# Altium schematic sheet mcu_shield.SchDoc
size A4
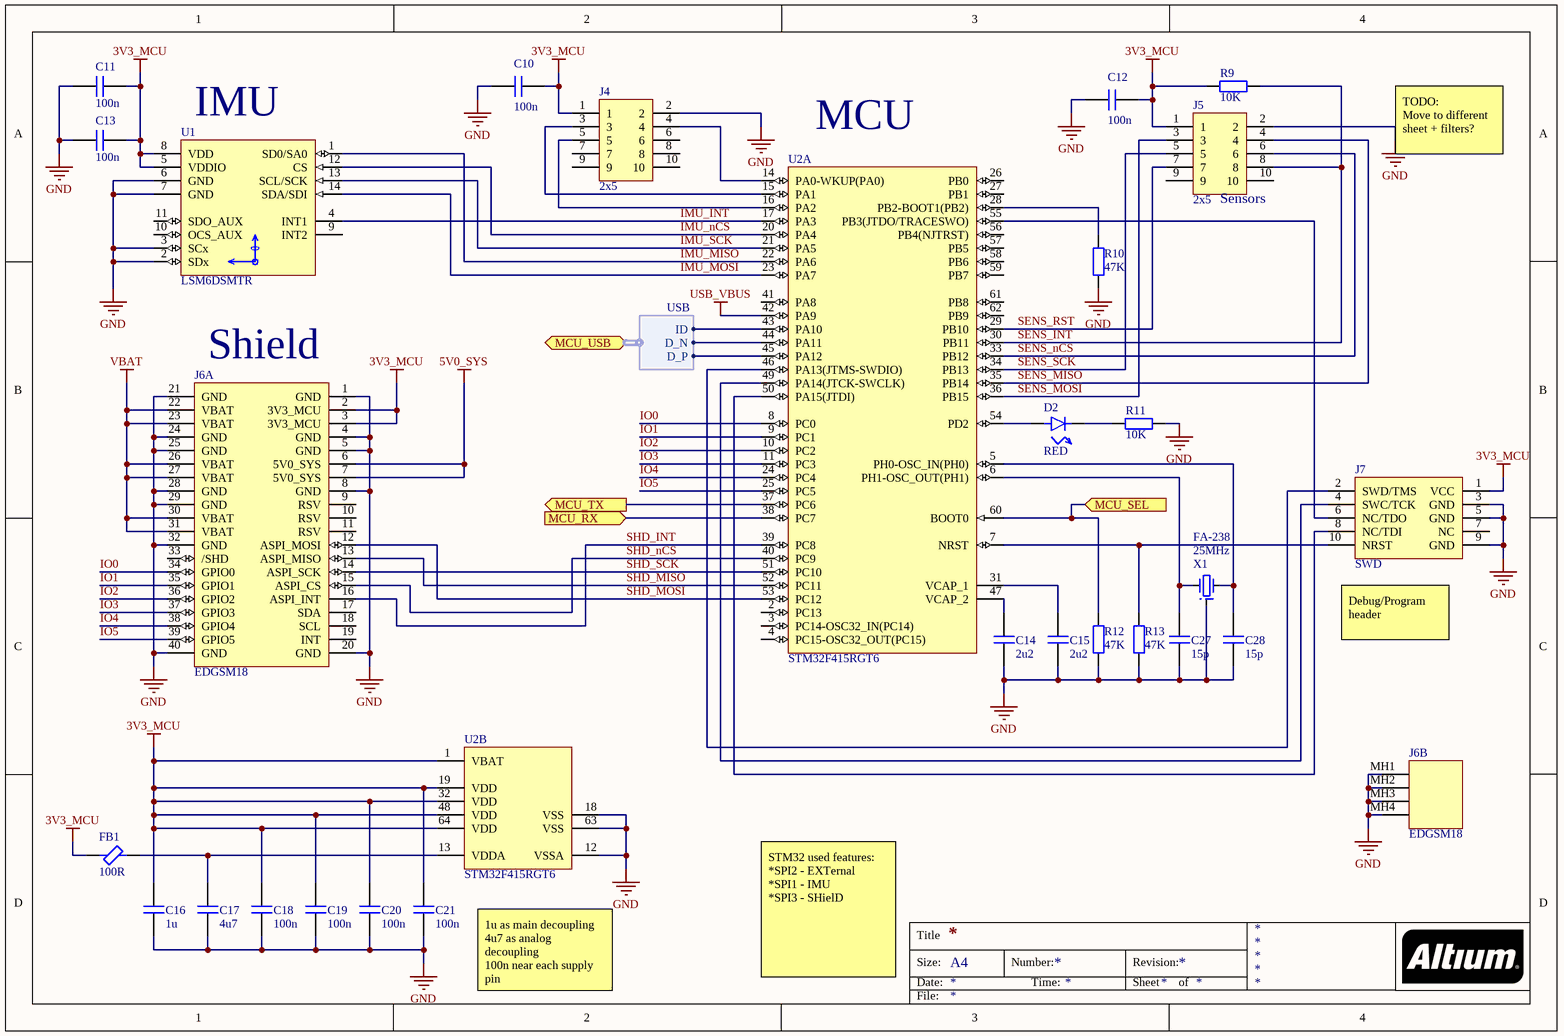
[diagram p0: mcu_shield.SchDoc]

## Parts
C10  value 100n  [CAPC1005X06N]  (hidden comment: cap)
C11  value 100n  [CAPC1005X06N]  (hidden comment: cap)
C12  value 100n  [CAPC1005X06N]  (hidden comment: cap)
C13  value 100n  [CAPC1005X06N]  (hidden comment: cap)
C14  value 2u2  [CAPC1608X08N]  (hidden comment: cap)
C15  value 2u2  [CAPC1608X08N]  (hidden comment: cap)
C16  value 1u  [CAPC1608X08N]  (hidden comment: cap)
C17  value 4u7  [CAPC1608X08N]  (hidden comment: cap)
C18  value 100n  [CAPC1005X06N]  (hidden comment: cap)
C19  value 100n  [CAPC1005X06N]  (hidden comment: cap)
C20  value 100n  [CAPC1005X06N]  (hidden comment: cap)
C21  value 100n  [CAPC1005X06N]  (hidden comment: cap)
C27  value 15p  [CAPC1005X06N]  (hidden comment: cap)
C28  value 15p  [CAPC1005X06N]  (hidden comment: cap)
D2  value RED  [CAPCP1005X06N]  (hidden comment: diode)
FB1  value 100R  [INDC1608X08N]  (hidden comment: ferrite)
J4  2x5  [hdr_2x5_50mil]
J5  2x5  [hdr_2x5_50mil]
J6  EDGSM18  [edgsm_shield]  (parts A,B of 2)
J7  SWD  [hdr_2x5_50mil]
R9  value 10K  [RESC1005X04N]  (hidden comment: res)
R10  value 47K  [RESC1005X04N]  (hidden comment: res)
R11  value 10K  [RESC1005X04N]  (hidden comment: res)
R12  value 47K  [RESC1005X04N]  (hidden comment: res)
R13  value 47K  [RESC1005X04N]  (hidden comment: res)
U1  LSM6DSMTR  [QFN50P300X250X86-14N]
U2  STM32F415RGT6  [STM-LQFP64_N]  (parts A,B of 2)
X1  FA-238  freq: 25MHz  [DFN220P320X70-4N]

## Ports
MCU_RX (in), MCU_SEL (in), MCU_TX (out), MCU_USB (harness USB)

## Harnesses
USB: D_N, D_P, ID

## Nets
3V3_MCU: C10.2 C11.1 C12.2 C13.1 C16.2 C18.2 C19.2 C20.2 C21.2 FB1.1 J4.1 J5.1 J6.2(3V3_MCU) J6.3(3V3_MCU) J7.1(VCC) R9.2 U1.5(VDDIO) U1.8(VDD) U2.1(VBAT) U2.19(VDD) U2.32(VDD) U2.48(VDD) U2.64(VDD)
5V0_SYS: J6.6(5V0_SYS) J6.7(5V0_SYS)
GND: C10.1 C11.2 C12.1 C13.2 C14.1 C15.1 C16.1 C17.1 C18.1 C19.1 C20.1 C21.1 C27.1 C28.1 J4.2 J5.2 J6.1(GND) J6.4(GND) J6.5(GND) J6.8(GND) J6.20(GND) J6.21(GND) J6.24(GND) J6.25(GND) J6.28(GND) J6.29(GND) J6.32(GND) J6.40(GND) J6.MH1 J6.MH2 J6.MH3 J6.MH4 J7.3(GND) J7.5(GND) J7.9(GND) R10.1 R11.2 R12.1 R13.1 U1.2(SDx) U1.3(SCx) U1.6(GND) U1.7(GND) U2.12(VSSA) U2.18(VSS) U2.63(VSS) X1.SHIELD
USB_VBUS: U2.42(PA9)
VBAT: J6.22(VBAT) J6.23(VBAT) J6.26(VBAT) J6.27(VBAT) J6.30(VBAT) J6.31(VBAT)
IMU_INT: U1.4(INT1) U2.17(PA3)
IMU_MISO: U1.1(SD0/SA0) U2.22(PA6)
IMU_MOSI: U1.14(SDA/SDI) U2.23(PA7)
IMU_nCS: U1.12(CS) U2.20(PA4)
IMU_SCK: U1.13(SCL/SCK) U2.21(PA5)
IO0: J6.34(GPIO0) U2.8(PC0)
IO1: J6.35(GPIO1) U2.9(PC1)
IO2: J6.36(GPIO2) U2.10(PC2)
IO3: J6.37(GPIO3) U2.11(PC3)
IO4: J6.38(GPIO4) U2.24(PC4)
IO5: J6.39(GPIO5) U2.25(PC5)
MCU_RX: U2.38(PC7) ; port MCU_RX
MCU_SEL: R12.2 U2.60(BOOT0) ; port MCU_SEL
MCU_TX: U2.37(PC6) ; port MCU_TX
SENS_INT: J5.8 R9.1 U2.30(PB11)
SENS_MISO: J5.4 U2.35(PB14)
SENS_MOSI: J5.3 U2.36(PB15)
SENS_nCS: J5.6 U2.33(PB12)
SENS_RST: J5.7 U2.29(PB10)
SENS_SCK: J5.5 U2.34(PB13)
SHD_INT: J6.16(ASPI_INT) U2.39(PC8)
SHD_MISO: J6.13(ASPI_MISO) U2.52(PC11)
SHD_MOSI: J6.12(ASPI_MOSI) U2.53(PC12)
SHD_nCS: J6.15(ASPI_CS) U2.40(PC9)
SHD_SCK: J6.14(ASPI_SCK) U2.51(PC10)
NetC14_2: C14.2 U2.47(VCAP_2)
NetC15_2: C15.2 U2.31(VCAP_1)
NetC17_2: C17.2 FB1.2 U2.13(VDDA)
NetC27_2: C27.2 U2.6(PH1-OSC_OUT(PH1)) X1.1
NetC28_2: C28.2 U2.5(PH0-OSC_IN(PH0)) X1.2
NetD2_A: D2.A U2.54(PD2)
NetD2_C: D2.C R11.1
NetJ4_3: J4.3 U2.15(PA1)
NetJ4_4: J4.4 U2.14(PA0-WKUP(PA0))
NetJ4_5: J4.5 U2.16(PA2)
NetJ7_2: J7.2(SWD/TMS) U2.46(PA13(JTMS-SWDIO))
NetJ7_4: J7.4(SWC/TCK) U2.49(PA14(JTCK-SWCLK))
NetJ7_6: J7.6(NC/TDO) U2.55(PB3(JTDO/TRACESWO))
NetJ7_8: J7.8(NC/TDI) U2.50(PA15(JTDI))
NetJ7_10: J7.10(NRST) R13.2 U2.7(NRST)
NetR10_2: R10.2 U2.28(PB2-BOOT1(PB2))
NetU2_43: U2.43(PA10) ; port MCU_USB.ID
NetU2_44: U2.44(PA11) ; port MCU_USB.D_N
NetU2_45: U2.45(PA12) ; port MCU_USB.D_P

Not connected (* = marked no-connect by the designer): J4 6 7 8 9 10; J5 9 10; J6 9(RSV) 10(RSV) 11(RSV) 17(SDA) 18(SCL) 19(INT) 33(/SHD); J7 7(NC); U1 9(INT2) 10(OCS_AUX) 11(SDO_AUX); U2 2(PC13) 3(PC14-OSC32_IN(PC14)) 4(PC15-OSC32_OUT(PC15)) 26(PB0) 27(PB1) 41(PA8) 56(PB4(NJTRST)) 57(PB5) 58(PB6) 59(PB7) 61(PB8) 62(PB9)

## Notes on the sheet
- (near U1) IMU
- (near U2) MCU
- TODO:
  Move to different sheet + filters?
- (near J5) Sensors
- (near J6) Shield
- (near J7) Debug/Program header
- 1u as main decoupling
  4u7 as analog decoupling
  100n near each supply pin
- STM32 used features:
  *SPI2 - EXTernal
  *SPI1 - IMU
  *SPI3 - SHielD
- Title
- Size:
- Date:
- A4
- Number:
- Time:
- Revision:
- Sheet
- of
- File:

## Library data of the parts
C10-C21 C27 C28 = cap: Capacitor
D2 = diode: pin to pad: A>1 C>2
FB1 = ferrite: Inductor
J4 J5 = hdr_2x5: 2x5 Header
J6 = edgsm18_shield
J7 = hdr_swd: SWD Header
R9-R13 = res: Resistor
U1 = lsm6dsmtr: 6DOF IMU acc+gyro
U2 = STM32F415RGT6: ARM Cortex-M4 32-bit MCU+FPU, 210 DMIPS, 1024 kB Flash, 192 kB Internal RAM, 51 I/Os, 64-pin LQFP, -40 to 85 degC, Tray; Manufacturer: STMicroelectronics; D/A Converter: 2x12-bit; FLASH Size (Prog) (kB): 1024; I/Os (High Current): 51; Internal RAM Size (kB): 192; Operating Frequency(F) (Processor speed) (MHz): 168; Supply Voltage(Vcc) max (V): 3.6; Supply Voltage(Vcc) min (V): 1.8; DatasheetVersion: Rev. 4; PackageVersion: Rev. 4, 06/2013; PackageReference: LQFP64; PackageDescription: 64-Pin Low Profile Quad Flat Package, 10 x 10 mm Body, 0.5 mm Pitch; Supplier 1: Digi-Key; Supplier Part Number 1: 497-11907-ND; Supplier 2: Farnell; Supplier Part Number 2: 2064370; Supplier 3: Newark; Supplier Part Number 3: 73T2335; Supplier 4: Mouser; Supplier Part Number 4: 511-STM32F415RGT6; Core: ARM Cortex-M4; Packing: Tray; Mounting Technology: Surface Mount; PartNumber: STM32F415RGT6; ComponentLink1Description: Manufacturer URL; ComponentLink1URL: http://www.st.com/web/en/home.html; ComponentLink2Description: Datasheet; ComponentLink2URL: http://www.st.com/st-web-ui/static/active/en/resource/technical/document/datasheet/DM00035129.pdf; ComponentLink3Description: Package Specification; ComponentLink3URL: http://www.st.com/st-web-ui/static/active/en/resource/technical/document/datasheet/DM00037051.pdf
X1 = crystal: Crystal With Shield